# EasyEDA schematic schematic.json
TITLE: Sheet_1; REV: 1.0; Date: 2024-08-17; Sheet: 1/1; Drawn By: shettynirek; Company: Your Company
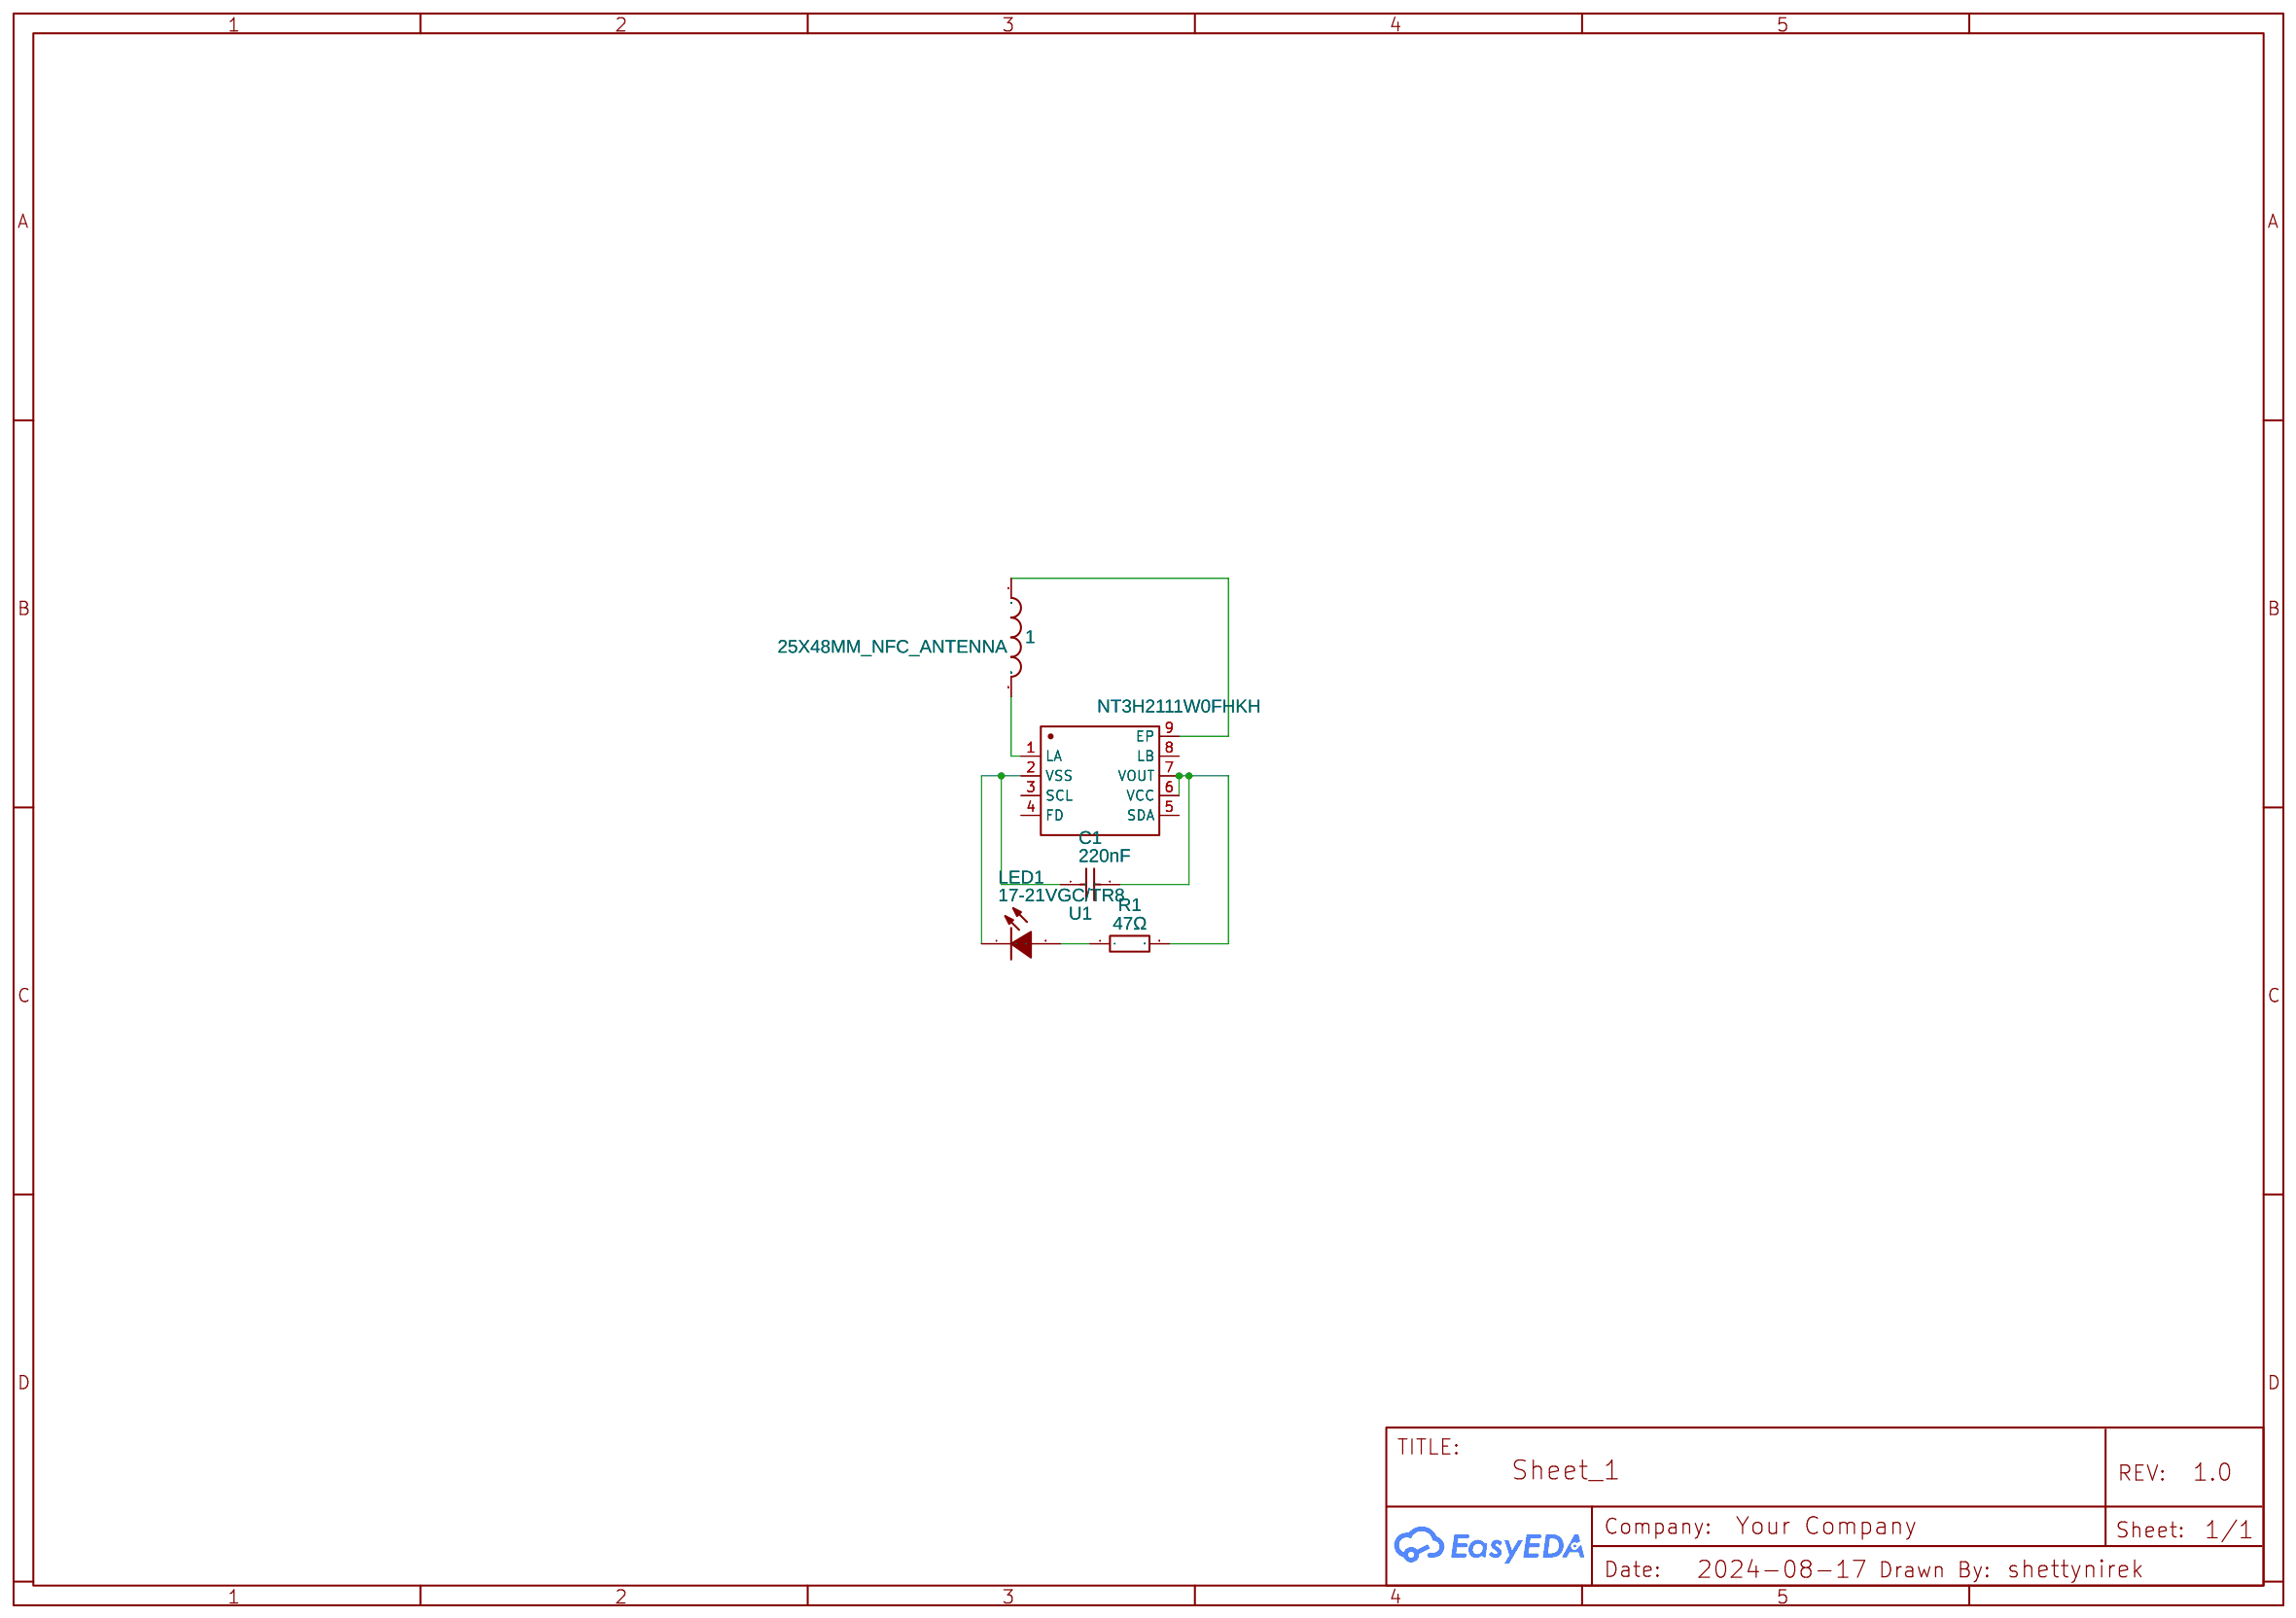
[diagram p0: schematic sheet]

## Parts
1  25X48MM_NFC_ANTENNA  [25X48MM_NFC_ANTENNA]
C1  220nF  [C0603]
LED1  17-21VGC/TR8  [LED0805-RD_GREEN]
R1  47Ω  [R0603]
U1  NT3H2111W0FHKH  [XQFN-8_L1.6-W1.6-P0.50-BL]

## Library data of the parts
1 = 25X48MM_NFC_ANTENNA: Contributor: LoneWalkerWolf
C1 = CL10B224KA8NNNC: Supplier: LCSC; Manufacturer: SAMSUNG(三星); Supplier Part: C21120; JLCPCB Part Class: Basic Part
LED1 = 17-21VGC/TR8: Contributor: LCSC; Supplier: LCSC; Supplier Part: C409514; Manufacturer: EVERLIGHT(亿光); JLCPCB Part Class: Extended Part
R1 = 0603WAF470JT5E: Supplier: LCSC; Manufacturer: UNI-ROYAL(厚声); Supplier Part: C23182; JLCPCB Part Class: Basic Part
U1 = NT3H2111W0FHKH: Contributor: LCSC; Supplier: LCSC; Supplier Part: C710403; Manufacturer: NXP(恩智浦); JLCPCB Part Class: Extended Part

## Nets
Net-(1-P$1): 1.P$1 U1.9(EP)
Net-(1-P$2): 1.P$2 U1.1(LA)
Net-(C1-1): C1.1 LED1.1(-) U1.2(VSS)
Net-(C1-2): C1.2 R1.2 U1.6(VCC) U1.7(VOUT)
Net-(LED1-2): LED1.2(+) R1.1

Not connected (* = marked no-connect by the designer): U1 3(SCL) 4(FD) 5(SDA) 8(LB)
